# Altium project STM32WB_module.PrjPcb
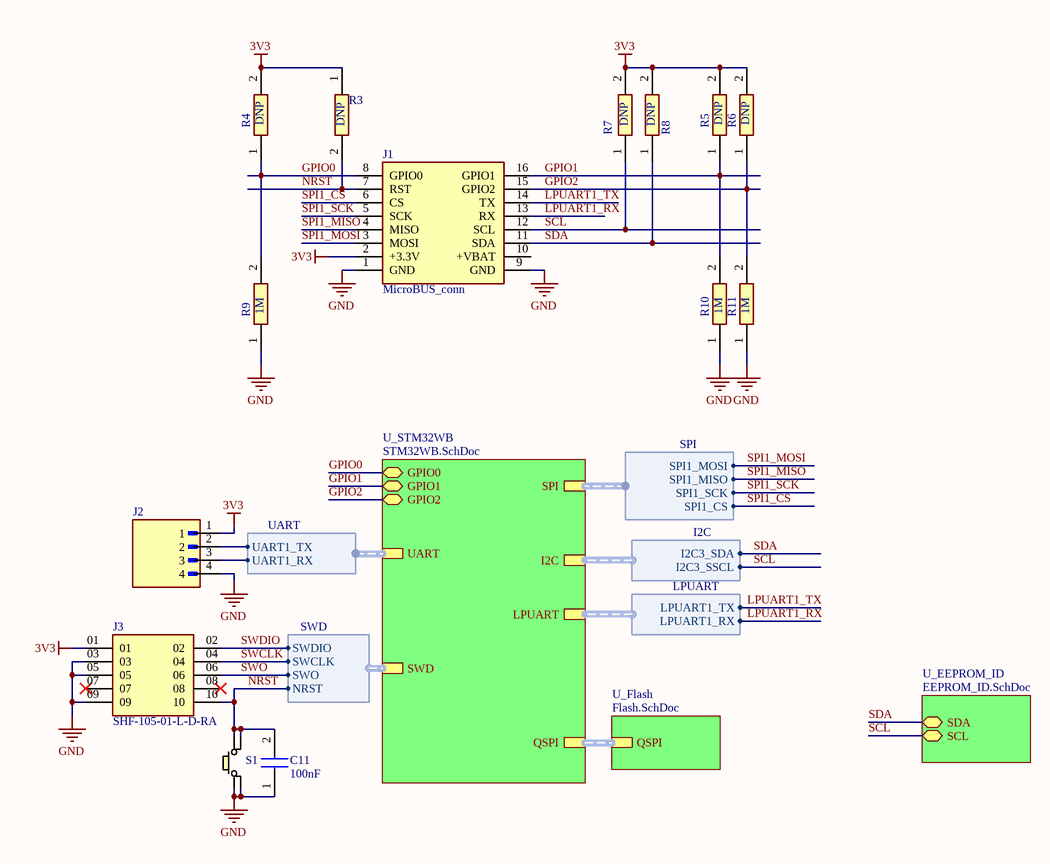
[diagram p0: main.SchDoc]
Revision: 1.0; Author: Evžen Šteif
4 sheets, 27 parts. Net scope: hierarchical (ports join the sheet entries above them; power ports are global).
Board file: STM32WB_module.PcbDoc
Sheets:
  main.SchDoc
    U_STM32WB = STM32WB.SchDoc
    U_Flash = Flash.SchDoc
    U_EEPROM_ID = EEPROM_ID.SchDoc

## Sheet main.SchDoc
size A4; SheetNumber: 1; SheetTotal: 4

### Parts
C11  100nF  [CAPC1005X70N]
J1  MicroBUS_conn  [MicroBUS_header]
J2  310-87-104-41-205101  [310-87-104-41-205101]  (value not drawn)
J3  SHF-105-01-L-D-RA  [SAMTEC_SHF-105-01-L-D-RA]
R3  DNP  [RESC1005X35N]
R4  DNP  [RESC1005X40N]
R5  DNP  [RESC1005X40N]
R6  DNP  [RESC1005X40N]
R7  DNP  [RESC1005X35N]
R8  DNP  [RESC1005X35N]
R9  1M  [RESC1005X40N]
R10  1M  [RESC1005X40N]
R11  1M  [RESC1005X40N]
S1  KMR731NG_LFS  [KMR731NGLFS]  (value not drawn)

### Sub-sheets
U_EEPROM_ID = EEPROM_ID.SchDoc: SDA (bidir), SCL (bidir)
U_Flash = Flash.SchDoc: QSPI (harness QSPI)
U_STM32WB = STM32WB.SchDoc: SWD (harness SWD), QSPI (harness QSPI), LPUART (harness LPUART), UART (harness UART), SPI (harness SPI), I2C (harness I2C), GPIO0 (bidir), GPIO1 (bidir), GPIO2 (bidir)

### Harnesses
SPI: SPI1_MOSI, SPI1_MISO, SPI1_SCK, SPI1_CS
UART: UART1_TX, UART1_RX
I2C: I2C3_SDA, I2C3_SSCL
LPUART: LPUART1_TX, LPUART1_RX
SWD: SWDIO, SWCLK, SWO, NRST

### Nets
3V3: J1.2(+3.3V) J2.1 J3.01 R3.1 R4.2 R5.2 R6.2 R7.2 R8.2
GND: C11.1 J1.1(GND) J1.9(GND) J2.4 J3.03 J3.05 J3.09 R9.1 R10.1 R11.1 S1.1 S1.2
GPIO0: J1.8(GPIO0) R4.1 R9.2 ; sheet U_STM32WB/GPIO0
GPIO1: J1.16(GPIO1) R5.1 R10.2 ; sheet U_STM32WB/GPIO1
GPIO2: J1.15(GPIO2) R6.1 R11.2 ; sheet U_STM32WB/GPIO2
LPUART1_RX: J1.13(RX) ; sheet U_STM32WB/LPUART.LPUART1_RX
LPUART1_TX: J1.14(TX) ; sheet U_STM32WB/LPUART.LPUART1_TX
NRST: C11.2 J1.7(RST) J3.10 R3.2 S1.3 S1.4 ; sheet U_STM32WB/SWD.NRST
SCL: J1.12(SCL) R7.1 ; sheet U_EEPROM_ID/SCL, sheet U_STM32WB/I2C.I2C3_SSCL  [project net I2C3_SCL]
SDA: J1.11(SDA) R8.1 ; sheet U_EEPROM_ID/SDA, sheet U_STM32WB/I2C.I2C3_SDA  [project net I2C3_SDA]
SPI1_CS: J1.6(CS) ; sheet U_STM32WB/SPI.SPI1_CS
SPI1_MISO: J1.4(MISO) ; sheet U_STM32WB/SPI.SPI1_MISO
SPI1_MOSI: J1.3(MOSI) ; sheet U_STM32WB/SPI.SPI1_MOSI
SPI1_SCK: J1.5(SCK) ; sheet U_STM32WB/SPI.SPI1_SCK
SWCLK: J3.04 ; sheet U_STM32WB/SWD.SWCLK
SWDIO: J3.02 ; sheet U_STM32WB/SWD.SWDIO
SWO: J3.06 ; sheet U_STM32WB/SWD.SWO
UART1_RX: J2.3 ; sheet U_STM32WB/UART.UART1_RX
UART1_TX: J2.2 ; sheet U_STM32WB/UART.UART1_TX

Not connected (* = marked no-connect by the designer): J1 10(+VBAT); J3 07* 08*

### Buses and harness runs
harness sheet U_Flash/QSPI = sheet U_STM32WB/QSPI

### Notes on the sheet
- Title:
- Date:
- Project:
- Type:
- Schematic
- Variant:
- Revision:
- Sheet
- of
- Author:
- Evžen Šteif
- Size:
- A4

### Library data of the parts
C11 = GRM155R61A104KA01D: Capacitor; Manufacturer_Name: Murata Electronics; Datasheet Link: https://search.murata.co.jp/Ceramy/image/img/A01X/G101/ENG/GRM155R61A104KA01-02A.pdf; Height: 0.7mm; Manufacturer_Part_Number: GRM155R61A104KA01D; Mouser Part Number: 81-GRM155R61A104KA01; Mouser Price/Stock: https://www.mouser.co.uk/ProductDetail/Murata-Electronics/GRM155R61A104KA01D?qs=5bAuhL3RhmNZw0v59AqOJA%3D%3D; Arrow Part Number: GRM155R61A104KA01D; Arrow Price/Stock: https://www.arrow.com/en/products/grm155r61a104ka01d/murata-manufacturing?utm_currency=USD&region=europe
J1 = MicroBUS_conn: Connector; Manufacturer_Name: Harwin; Manufacturer_Part_Number: M20-9730845; Datasheet Link: https://cdn.harwin.com/pdfs/M20-973.pdf; Height: 9.54mm; Mouser Part Number: 855-M20-9730845; Mouser Price/Stock: https://www.mouser.co.uk/ProductDetail/Harwin/M20-9730845?qs=%252Bk6%2F5FB6qrnRfgIEPS4Dkw%3D%3D
J3 = SHF-105-01-L-D-RA: MF: Samtec; Value: *; Package: None; Price: None; MP: SHF-105-01-L-D-RA; Availability: Unavailable
R3 = RT0402FRE07100KL: Resistor; Manufacturer_Name: KEMET; Datasheet Link: https://www.yageo.com/upload/media/product/productsearch/datasheet/rchip/PYu-RT_1-to-0.01_RoHS_L_11.pdf; Height: 0.35mm; Manufacturer_Part_Number: RT0402FRE07100KL; Mouser Part Number: 603-RT0402FRE07100KL; Mouser Price/Stock: https://www.mouser.co.uk/ProductDetail/YAGEO/RT0402FRE07100KL?qs=BXCcY9r%252B08CxTvf5JB1kiw%3D%3D; Arrow Part Number: RT0402FRE07100KL; Arrow Price/Stock: https://www.arrow.com/en/products/rt0402fre07100kl/yageo
R4-R6 R9-R11 = RC0402FR-071ML: Resistor; Manufacturer_Name: YAGEO; Datasheet Link: https://componentsearchengine.com/Datasheets/2/RC0402FR-071ML.pdf; Height: 0.4mm; Manufacturer_Part_Number: RC0402FR-071ML; Mouser Part Number: 603-RC0402FR-071ML; Mouser Price/Stock: https://www.mouser.co.uk/ProductDetail/YAGEO/RC0402FR-071ML?qs=V1yeUXFNrknfoI4987wfBQ%3D%3D; Arrow Part Number: RC0402FR-071ML; Arrow Price/Stock: https://www.arrow.com/en/products/rc0402fr-071ml/yageo?region=nac
R7 R8 = RT0402FRE075K1L: Resistor; Manufacturer_Name: YAGEO; Datasheet Link: https://www.yageo.com/upload/media/product/app/datasheet/rchip/pyu-rt_1-to-0.01_rohs_l.pdf; Height: 0.35mm; Manufacturer_Part_Number: RT0402FRE075K1L; Mouser Part Number: RT0402FRE075K1L; Mouser Price/Stock: https://www.mouser.co.uk/ProductDetail/YAGEO/RT0402FRE07100RL?qs=BXCcY9r%252B08AcvLZjF7vcwQ%3D%3D
S1 = KMR731NG_LFS: Switch; Manufacturer_Name: C & K COMPONENTS; Manufacturer_Part_Number: KMR731NG LFS; Datasheet Link: https://www.ckswitches.com/media/1908/kmr7.pdf; Mouser Part Number: 611-KMR731NGLFS; Mouser Price/Stock: https://www.mouser.com/Search/Refine.aspx?Keyword=611-KMR731NGLFS; Arrow Part Number: KMR731NG LFS; Arrow Price/Stock: https://www.arrow.com/en/products/kmr731nglfs/ck

## Sheet STM32WB.SchDoc
size A4; SheetNumber: 2; SheetTotal: 4
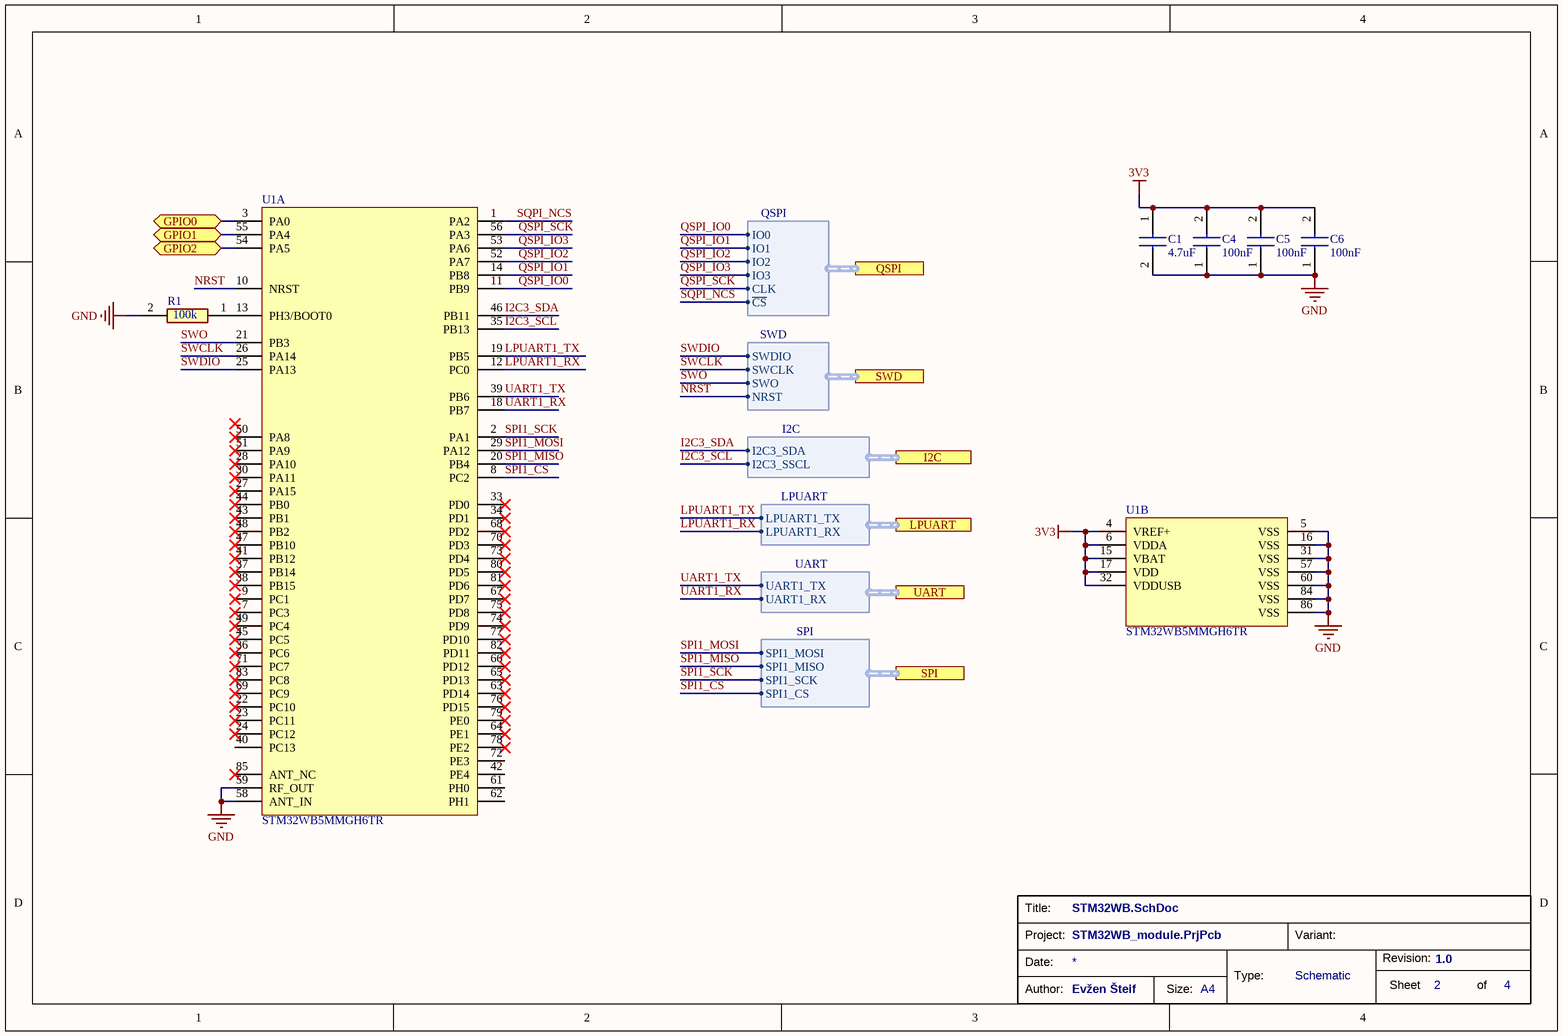
[diagram p1: STM32WB.SchDoc]

### Parts
C1  4.7uF  [CAPC1608X90N]
C4  100nF  [CAPC1005X70N]
C5  100nF  [CAPC1005X70N]
C6  100nF  [CAPC1005X70N]
R1  100k  [RESC1005X35N]
U1  STM32WB5MMGH6TR  [MOD_DORY_STM_86P_7P3X11_H1P342_Ref2]  (parts A,B of 2)

### Ports
GPIO0 (bidir, see main[2B]), GPIO1 (bidir, see main[2C]), GPIO2 (bidir, see main[2C]), I2C (harness I2C, see main[3C]), LPUART (harness LPUART, see main[3C]), QSPI (harness QSPI, see main[3D], Flash[1C]), SPI (harness SPI, see main[3C]), SWD (harness SWD, see main[2C]), UART (harness UART, see main[2C])

### Harnesses
SWD: SWDIO, SWCLK, SWO, NRST
QSPI: IO0, IO1, IO2, IO3, CLK, ~{CS}
I2C: I2C3_SDA, I2C3_SSCL
LPUART: LPUART1_TX, LPUART1_RX
UART: UART1_TX, UART1_RX
SPI: SPI1_MOSI, SPI1_MISO, SPI1_SCK, SPI1_CS

### Nets
3V3: C1.1 C4.2 C5.2 C6.2 U1.4(VREF+) U1.6(VDDA) U1.15(VBAT) U1.17(VDD) U1.32(VDDUSB)
GND: C1.2 C4.1 C5.1 C6.1 R1.2 U1.5(VSS) U1.16(VSS) U1.31(VSS) U1.57(VSS) U1.58(ANT_IN) U1.59(RF_OUT) U1.60(VSS) U1.84(VSS) U1.86(VSS)
GPIO0: U1.3(PA0) ; port GPIO0
GPIO1: U1.55(PA4) ; port GPIO1
GPIO2: U1.54(PA5) ; port GPIO2
I2C3_SCL: U1.35(PB13) ; port I2C.I2C3_SSCL
I2C3_SDA: U1.46(PB11) ; port I2C.I2C3_SDA
LPUART1_RX: U1.12(PC0) ; port LPUART.LPUART1_RX
LPUART1_TX: U1.19(PB5) ; port LPUART.LPUART1_TX
NRST: U1.10(NRST) ; port SWD.NRST
QSPI_IO0: U1.11(PB9) ; port QSPI.IO0  [project net IO0]
QSPI_IO1: U1.14(PB8) ; port QSPI.IO1  [project net IO1]
QSPI_IO2: U1.52(PA7) ; port QSPI.IO2  [project net IO2]
QSPI_IO3: U1.53(PA6) ; port QSPI.IO3  [project net IO3]
QSPI_SCK: U1.56(PA3) ; port QSPI.CLK  [project net CLK]
SPI1_CS: U1.8(PC2) ; port SPI.SPI1_CS
SPI1_MISO: U1.20(PB4) ; port SPI.SPI1_MISO
SPI1_MOSI: U1.29(PA12) ; port SPI.SPI1_MOSI
SPI1_SCK: U1.2(PA1) ; port SPI.SPI1_SCK
SQPI_NCS: U1.1(PA2) ; port QSPI.~{CS}  [project net CS]
SWCLK: U1.26(PA14) ; port SWD.SWCLK
SWDIO: U1.25(PA13) ; port SWD.SWDIO
SWO: U1.21(PB3) ; port SWD.SWO
UART1_RX: U1.18(PB7) ; port UART.UART1_RX
UART1_TX: U1.39(PB6) ; port UART.UART1_TX
NetR1_1: R1.1 U1.13(PH3/BOOT0)

Not connected (* = marked no-connect by the designer): U1 7(PC3)* 9(PC1)* 22(PC10)* 23(PC11)* 24(PC12)* 27(PA15)* 28(PA10)* 30(PA11)* 33(PD0)* 34(PD1)* 36(PC6)* 37(PB14)* 38(PB15)* 40(PC13) 41(PB12)* 42(PE4) 43(PB1)* 44(PB0)* 45(PC5)* 47(PB10)* 48(PB2)* 49(PC4)* 50(PA8)* 51(PA9)* 61(PH0) 62(PH1) 63(PD14)* 64(PE1)* 65(PD13)* 66(PD12)* 67(PD7)* 68(PD2)* 69(PC9)* 70(PD3)* 71(PC7)* 72(PE3) 73(PD4)* 74(PD9)* 75(PD8)* 76(PD15)* 77(PD10)* 78(PE2)* 79(PE0)* 80(PD5)* 81(PD6)* 82(PD11)* 83(PC8)* 85(ANT_NC)*

### Notes on the sheet
- Title:
- Date:
- Project:
- Type:
- Schematic
- Variant:
- Revision:
- Sheet
- of
- Author:
- Evžen Šteif
- Size:
- A4

### Library data of the parts
C1 = GRM188R61E475KE11J: Capacitor; Manufacturer_Name: Murata Electronics; Datasheet Link: https://search.murata.co.jp/Ceramy/image/img/A01X/G101/ENG/GRM188R61E475KE11-01A.pdf; Height: 0.9mm; Manufacturer_Part_Number: GRM188R61E475KE11J; Mouser Part Number: 81-GRM188R61E475KE1J; Mouser Price/Stock: https://www.mouser.co.uk/ProductDetail/Murata-Electronics/GRM188R61E475KE11J?qs=hNud%2FORuBR3%2Fa9GLJFT8KA%3D%3D; Arrow Part Number: GRM188R61E475KE11J; Arrow Price/Stock: https://www.arrow.com/en/products/grm188r61e475ke11j/murata-manufacturing
C4-C6 = GRM155R61A104KA01D: as C11 on sheet main; Datasheet Link: https://search.murata.co.jp/Ceramy/image/img/A01X/G101/ENG/GRM155R61A104KA01-02A.pdf; Height: 0.7mm; Manufacturer_Part_Number: GRM155R61A104KA01D; Mouser Part Number: 81-GRM155R61A104KA01; Mouser Price/Stock: https://www.mouser.co.uk/ProductDetail/Murata-Electronics/GRM155R61A104KA01D?qs=5bAuhL3RhmNZw0v59AqOJA%3D%3D; Arrow Part Number: GRM155R61A104KA01D; Arrow Price/Stock: https://www.arrow.com/en/products/grm155r61a104ka01d/murata-manufacturing?utm_currency=USD&region=europe
R1 = RT0402FRE07100KL: Resistor; Manufacturer_Name: KEMET; Datasheet Link: https://www.yageo.com/upload/media/product/productsearch/datasheet/rchip/PYu-RT_1-to-0.01_RoHS_L_11.pdf; Height: 0.35mm; Manufacturer_Part_Number: RT0402FRE07100KL; Mouser Part Number: 603-RT0402FRE07100KL; Mouser Price/Stock: https://www.mouser.co.uk/ProductDetail/YAGEO/RT0402FRE07100KL?qs=BXCcY9r%252B08CxTvf5JB1kiw%3D%3D; Arrow Part Number: RT0402FRE07100KL; Arrow Price/Stock: https://www.arrow.com/en/products/rt0402fre07100kl/yageo
U1 = STM32WB5MMGH6TR: MCU module, LGA-86, Cortex-M4, 64 MHz, 1 MB Flash, 256 kB RAM, BLE 5.4, 802.15.4; Manufacturer: STMicroelectronics; Part Name: STM32WB5MMGH6TR; Supplier: Mouser; Supplier Part Number: 511-STM32WB5MMGH6TR; Manufacturer Part Number: STM32WB5MMGH6TR; Category: MCUs; Case/Package: LGA-86; Min Operating Temperature: -40°C; Max Operating Temperature: 85°C; Datasheet: https://www.st.com/resource/en/datasheet/stm32wb5mmg.pdf

## Sheet Flash.SchDoc
size A4; SheetNumber: 3; SheetTotal: 4
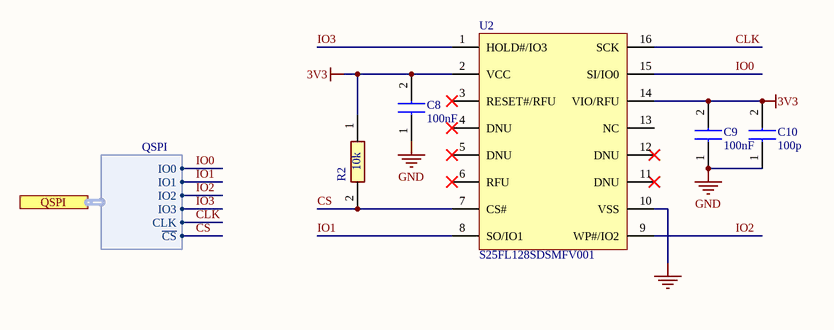
[diagram p2: Flash.SchDoc]

### Parts
C8  100nF  [CAPC1005X70N]
C9  100nF  [CAPC1005X70N]
C10  100p  [CAPC1005X70N]
R2  10k  [RESC1005X35N]
U2  S25FL128SDSMFV001  [ICC_SOIC16_10P30X7P50_P127_H2P65]

### Ports
QSPI (harness QSPI, see main[3D], STM32WB[3B])

### Harnesses
QSPI: IO0, IO1, IO2, IO3, CLK, ~{CS}

### Nets
3V3: C8.2 C9.2 C10.2 R2.1 U2.2(VCC) U2.14(VIO/RFU)
GND: C8.1 C9.1 C10.1 U2.10(VSS)
CLK: U2.16(SCK) ; port QSPI.CLK
CS: R2.2 U2.7(CS#) ; port QSPI.~{CS}
IO0: U2.15(SI/IO0) ; port QSPI.IO0
IO1: U2.8(SO/IO1) ; port QSPI.IO1
IO2: U2.9(WP#/IO2) ; port QSPI.IO2
IO3: U2.1(HOLD#/IO3) ; port QSPI.IO3

Not connected (* = marked no-connect by the designer): U2 3(RESET#/RFU)* 4(DNU)* 5(DNU)* 6(RFU)* 11(DNU)* 12(DNU)* 13(NC)

### Notes on the sheet
- Title:
- Date:
- Project:
- Type:
- Schematic
- Variant:
- Revision:
- Sheet
- of
- Author:
- Evžen Šteif
- Size:
- A4

### Library data of the parts
C8 C9 = GRM155R61A104KA01D: as C11 on sheet main; Datasheet Link: https://search.murata.co.jp/Ceramy/image/img/A01X/G101/ENG/GRM155R61A104KA01-02A.pdf; Height: 0.7mm; Manufacturer_Part_Number: GRM155R61A104KA01D; Mouser Part Number: 81-GRM155R61A104KA01; Mouser Price/Stock: https://www.mouser.co.uk/ProductDetail/Murata-Electronics/GRM155R61A104KA01D?qs=5bAuhL3RhmNZw0v59AqOJA%3D%3D; Arrow Part Number: GRM155R61A104KA01D; Arrow Price/Stock: https://www.arrow.com/en/products/grm155r61a104ka01d/murata-manufacturing?utm_currency=USD&region=europe
C10 = GRM1555C1E101JA01D: Capacitor; Manufacturer_Name: Murata Electronics; Datasheet Link: https://search.murata.co.jp/Ceramy/image/img/A01X/G101/ENG/GRM1555C1E101JA01-01A.pdf; Height: 0.7mm; Manufacturer_Part_Number: GRM1555C1E101JA01D; Mouser Part Number: 81-GRM1555C1E101JA1D; Mouser Price/Stock: https://www.mouser.co.uk/ProductDetail/Murata-Electronics/GRM1555C1E101JA01D?qs=wzfj1GSNDILQV4cKnk3IaA%3D%3D; Arrow Part Number: GRM1555C1E101JA01D; Arrow Price/Stock: https://www.arrow.com/en/products/grm1555c1e101ja01d/murata-manufacturing
R2 = RT0402FRE0710KL: Resistor; Manufacturer_Name: KEMET; Datasheet Link: https://cz.mouser.com/datasheet/2/447/PYu_RT_1_to_0_01_RoHS_L_15-3461507.pdf; Height: 0.35mm; Manufacturer_Part_Number: RT0402FRE0710KL; Mouser Part Number: 603-RT0402FRE0710KL; Mouser Price/Stock: https://www.mouser.co.uk/ProductDetail/YAGEO/RT0402FRE07100KL?qs=BXCcY9r%252B08CxTvf5JB1kiw%3D%3D; Arrow Part Number: RT0402FRE07100KL; Arrow Price/Stock: https://www.arrow.com/en/products/rt0402fre07100kl/yageo
U2 = S25FL128SDSMFV001: Quad SPI with SOIC package 16-pins; Internal_Part_Number: MCD-02038; Part_Type: IC; Manufacturer: CYPRESS; Part_Preference: Recommended; Value: S25FL128SDSMFV001; Order_Code_Digikey: S25FL128SDSMFV001-ND; Order_Code_Farnell: N/A; Order_Code_RS: N/A; Status: Released; ComponentLink1URL: http://tunmcdsvn.tun.st.com/Component_Datasheet_Library/Trunk/IC/Cypress_128_Mbit_3V_S25FL128SDSMFV001; Manufacturer_Part_Number: S25FL128SDSMFV001; Alternate_Manufacturer_Part_Number: N/A; Alternate_Manufacturer: N/A; Package: SOIC 16-pins

## Sheet EEPROM_ID.SchDoc
size A4; SheetNumber: 4; SheetTotal: 4
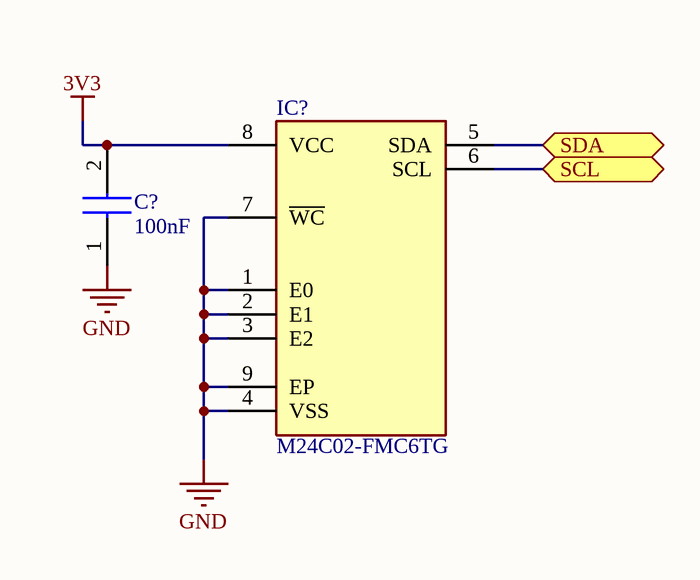
[diagram p3: EEPROM_ID.SchDoc]

### Parts
C?  100nF  [CAPC1005X70N]
IC?  M24C02-FMC6TG  [M24C02FMC6TG]

### Ports
SCL (bidir, see main[4D]), SDA (bidir, see main[4C])

### Nets
3V3: C?.2 IC?.8(VCC)
GND: C?.1 IC?.1(E0) IC?.2(E1) IC?.3(E2) IC?.4(VSS) IC?.7(~{WC}) IC?.9(EP)
I2C3_SCL: IC?.6(SCL) ; port SCL
I2C3_SDA: IC?.5(SDA) ; port SDA

### Notes on the sheet
- Title:
- Date:
- Project:
- Type:
- Schematic
- Variant:
- Revision:
- Sheet
- of
- Author:
- Evžen Šteif
- Size:
- A4

### Library data of the parts
C? = GRM155R61A104KA01D: as C11 on sheet main; Datasheet Link: https://search.murata.co.jp/Ceramy/image/img/A01X/G101/ENG/GRM155R61A104KA01-02A.pdf; Height: 0.7mm; Manufacturer_Part_Number: GRM155R61A104KA01D; Mouser Part Number: 81-GRM155R61A104KA01; Mouser Price/Stock: https://www.mouser.co.uk/ProductDetail/Murata-Electronics/GRM155R61A104KA01D?qs=5bAuhL3RhmNZw0v59AqOJA%3D%3D; Arrow Part Number: GRM155R61A104KA01D; Arrow Price/Stock: https://www.arrow.com/en/products/grm155r61a104ka01d/murata-manufacturing?utm_currency=USD&region=europe
IC? = M24C02-FMC6TG: Integrated Circuit; Manufacturer_Name: STMicroelectronics; Datasheet Link: https://www.st.com/resource/en/datasheet/m24c01-r.pdf; Height: 0.6mm; Manufacturer_Part_Number: M24C02-FMC6TG; Mouser Part Number: 511-M24C02-FMC6TG; Mouser Price/Stock: https://www.mouser.co.uk/ProductDetail/STMicroelectronics/M24C02-FMC6TG?qs=WHlX%252B%252B9%2FRwB%252BxJ8bQxWbzQ%3D%3D; Arrow Part Number: M24C02-FMC6TG; Arrow Price/Stock: https://www.arrow.com/en/products/m24c02-fmc6tg/stmicroelectronics?region=nac

## Nets that join several sheets
3V3: main (9 pins), STM32WB (9 pins), Flash (6 pins), EEPROM_ID (C?.2 IC?.8)
GND: main (12 pins), STM32WB (14 pins), Flash (C8.1 C9.1 C10.1 U2.10), EEPROM_ID (7 pins)
CLK: STM32WB (U1.56), Flash (U2.16)
CS: STM32WB (U1.1), Flash (R2.2 U2.7)
GPIO0: main (J1.8 R4.1 R9.2), STM32WB (U1.3)
GPIO1: main (J1.16 R5.1 R10.2), STM32WB (U1.55)
GPIO2: main (J1.15 R6.1 R11.2), STM32WB (U1.54)
I2C3_SCL: main (J1.12 R7.1), STM32WB (U1.35), EEPROM_ID (IC?.6)
I2C3_SDA: main (J1.11 R8.1), STM32WB (U1.46), EEPROM_ID (IC?.5)
IO0: STM32WB (U1.11), Flash (U2.15)
IO1: STM32WB (U1.14), Flash (U2.8)
IO2: STM32WB (U1.52), Flash (U2.9)
IO3: STM32WB (U1.53), Flash (U2.1)
LPUART1_RX: main (J1.13), STM32WB (U1.12)
LPUART1_TX: main (J1.14), STM32WB (U1.19)
NRST: main (6 pins), STM32WB (U1.10)
SPI1_CS: main (J1.6), STM32WB (U1.8)
SPI1_MISO: main (J1.4), STM32WB (U1.20)
SPI1_MOSI: main (J1.3), STM32WB (U1.29)
SPI1_SCK: main (J1.5), STM32WB (U1.2)
SWCLK: main (J3.04), STM32WB (U1.26)
SWDIO: main (J3.02), STM32WB (U1.25)
SWO: main (J3.06), STM32WB (U1.21)
UART1_RX: main (J2.3), STM32WB (U1.18)
UART1_TX: main (J2.2), STM32WB (U1.39)

## Assembly variants
STM32WB_assembly: not fitted R3 R4 R5 R6 R7 R8